# Altium schematic sheet 01 COVER.SchDoc
size A2; VersionControl_RevNumber: DNP; IsUserConfigurable: DNP; OrgAddr3: Sunrise FL 33323; OrgName: Pixels on Target; Page Create Date: March  8, 1995; Page Number: 5; Page Size: A2; Page Count: 14; OrgAddr2: Suite #104; RevCode: A; Doc: SCH30-00070-00; DsnPath: C:\Users\Carter Nichols\Documents\BitBucket boards (Cadence)\30-00070-00_Original\SCH30-00070-00.DSN; SchematicName: SC30-00070-00; PageName: 05-POWER IN; PageSize: A2; TopSchematic: True; Address4: United States
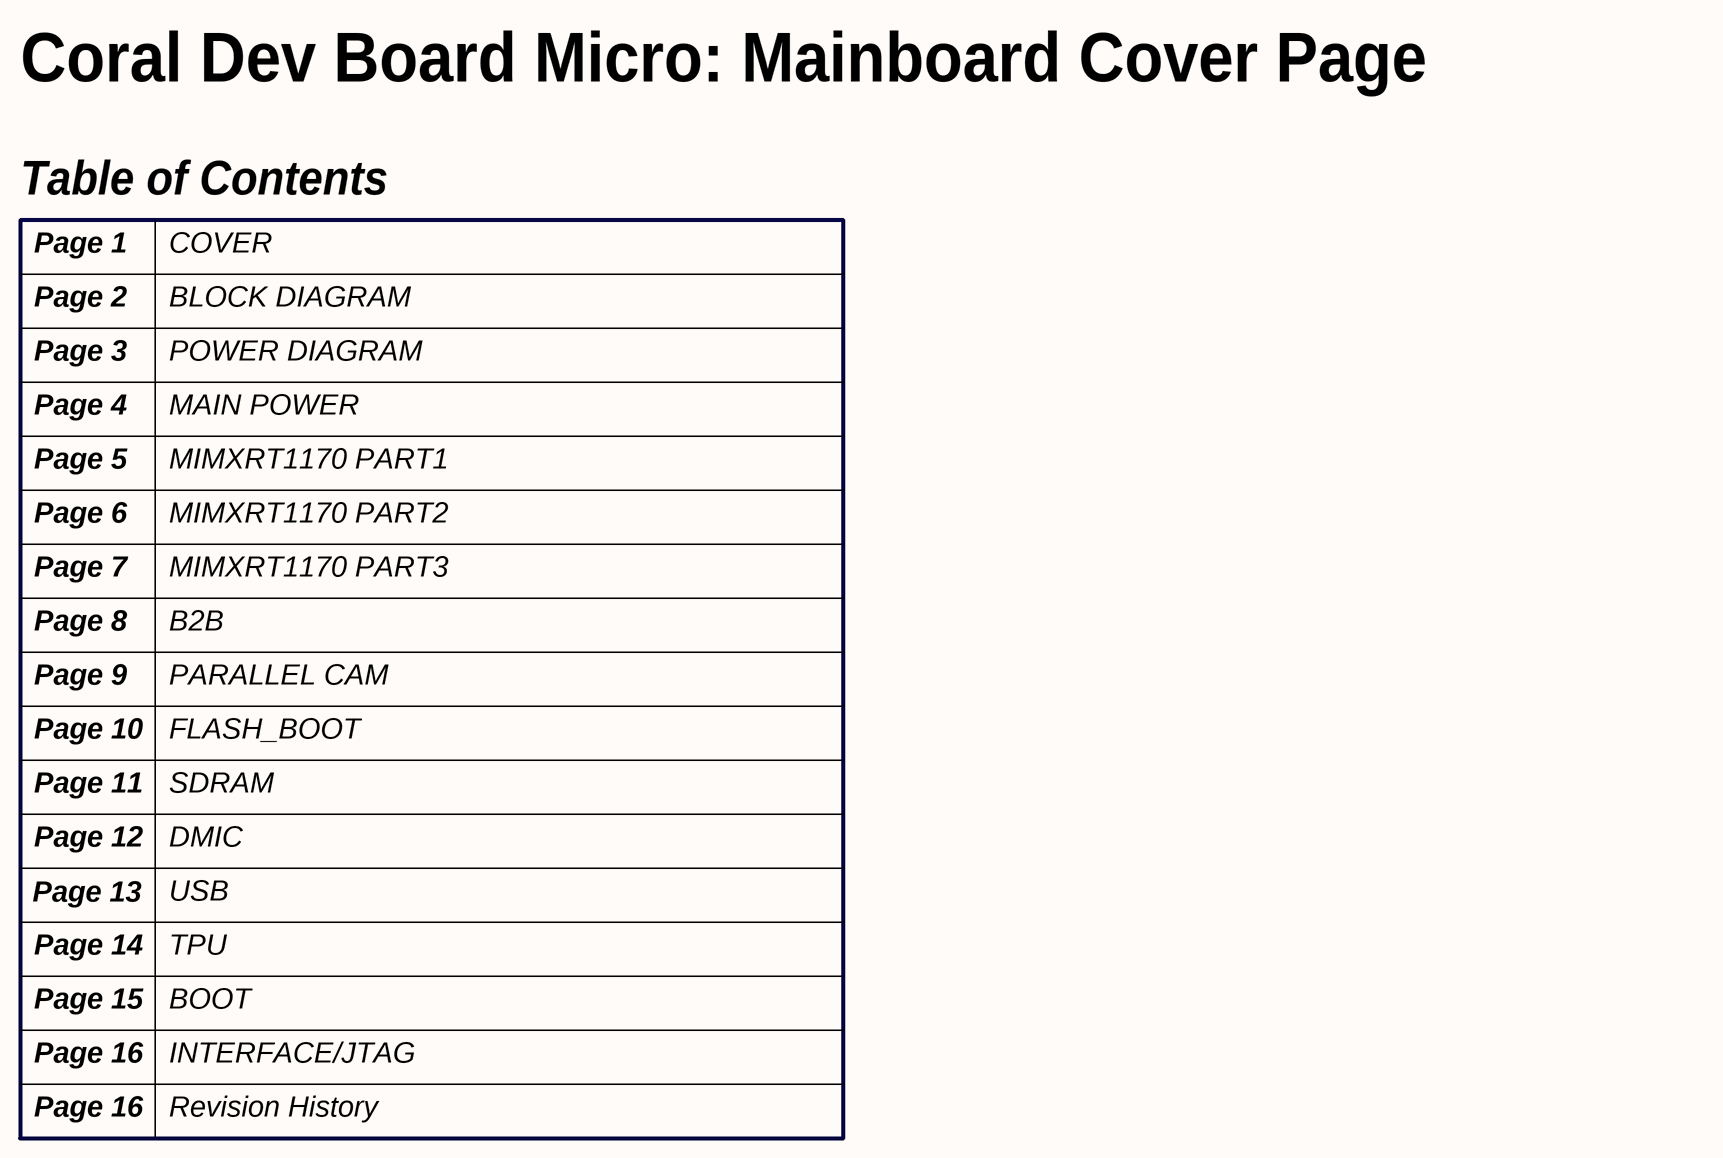
[diagram p0: 01 COVER.SchDoc]

## Notes on the sheet
- Coral Dev Board Micro: Mainboard Cover Page
- Table of Contents
- Page 1
- Page 2
- COVER
- BLOCK DIAGRAM
- Page 3
- POWER DIAGRAM
- Page 4
- MAIN POWER
- Page 5
- MIMXRT1170 PART1
- Page 6
- Page 7
- MIMXRT1170 PART3
- MIMXRT1170 PART2
- Page 8
- B2B
- Page 9
- PARALLEL CAM
- Page 10
- FLASH_BOOT
- Page 11
- Page 12
- SDRAM
- DMIC
- Page 13
- USB
- Page 14
- TPU
- Page 15
- BOOT
- Page 16
- INTERFACE/JTAG
- Revision History
- Title
- Size:
- Date:
- File:
- A2
- Number:
- Time:
- Revision:
- Sheet
- of